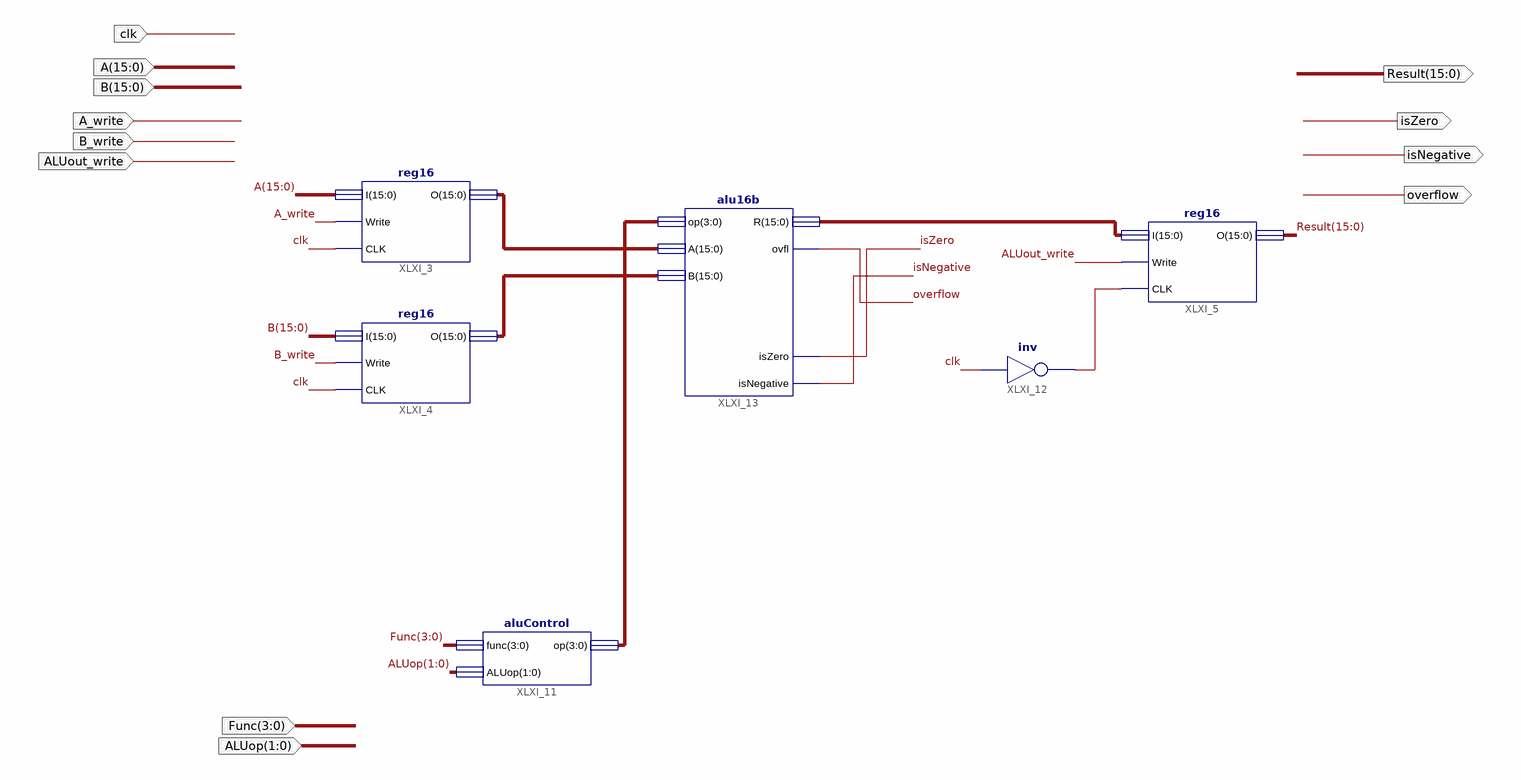
[diagram p0: schematic sheet 1]
// Xilinx ISE schematic Full_ALU.sch (spartan3e) as structural Verilog: 6 symbols, 12 ports
module Full_ALU (
  input  clk,
  input  [15:0] A,
  input  [15:0] B,
  input  A_write,
  input  B_write,
  input  ALUout_write,
  input  [3:0] Func,
  input  [1:0] ALUop,
  output [15:0] Result,
  output isNegative,
  output overflow,
  output isZero
);

  wire XLXN_52;
  wire [3:0] Control_op;
  wire [15:0] Ain, Bin, XLXN_51;

  reg16 XLXI_3 (.I(A), .Write(A_write), .CLK(clk), .O(Ain));
  reg16 XLXI_4 (.I(B), .Write(B_write), .CLK(clk), .O(Bin));
  reg16 XLXI_5 (.I(XLXN_51), .Write(ALUout_write), .CLK(XLXN_52), .O(Result));
  aluControl XLXI_11 (.ALUop(ALUop), .func(Func), .op(Control_op));
  not XLXI_12 (XLXN_52, clk);
  alu16b XLXI_13 (
    .A(Ain), .B(Bin), .op(Control_op), .isZero(isZero), .isNegative(isNegative), .ovfl(overflow), .R(XLXN_51));
endmodule
